# EAGLE design breakout (EAGLE 7.5.0)
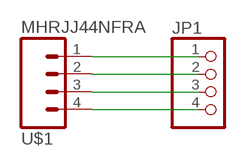
[diagram p0: schematic, sheet 1]

## Parts
JP1  PINHD-1X4  [1X04]
U$1  MHRJJ44NFRA  RJ9PTH  [RJ9]

## Nets
N$1: JP1.1 U$1.1
N$2: JP1.2 U$1.2
N$3: JP1.3 U$1.3
N$4: JP1.4 U$1.4

## Library data of the parts
JP1 = pinhead:PINHD-1X4: PIN HEADER
U$1 = SparkFun-Connectors:RJ9: RJ9 connector (e.g., phone handsets)

## Board
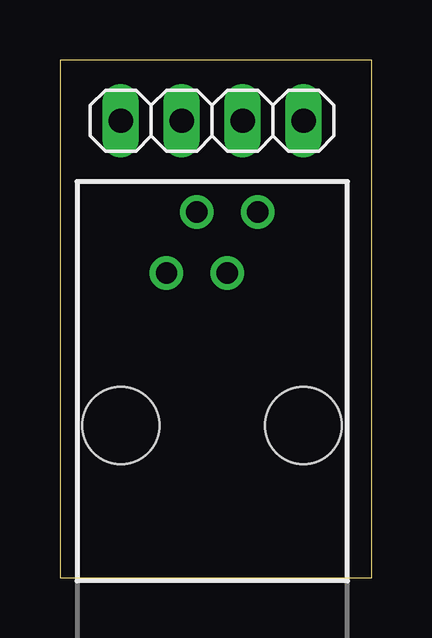
[diagram p1: board, top side]
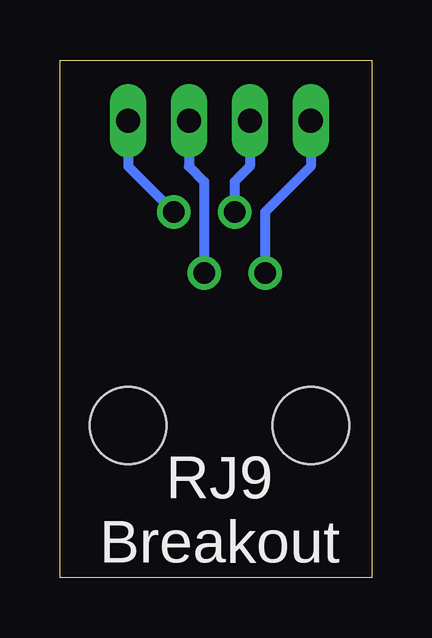
[diagram p2: board, bottom side, seen from below]

Size 13.01 x 21.58 mm. Coordinates in mm from the lower left corner, seen from the top.
Outline: 0,0 13.01,0 13.01,21.58 0,21.58 0,0
Copper layers (1*16): Top 0.035mm / dielectric 1.5mm / Bottom 0.035mm
Design rules "default": minimum track width 10mil, minimum drill 24mil, track to track 8mil, track to pad 8mil, pad to pad 8mil, via to via 8mil, smd to smd 8mil, copper to edge 40mil, drill to drill 8mil, minimum pad ring 10mil, minimum via ring 8mil, stop-mask expansion 4mil, vias tented up to drill 0mil, thermal gap 10mil

### Footprints (pad centres in the part's own frame; a part is rotated, then mirrored left to right if it is on the bottom)
1X04 = drill 1.016 long: 1 -3.81,0; 2 -1.27,0; 3 1.27,0; 4 3.81,0
RJ9 = drill 0.889: 1 -1.905,6.35; 2 -0.635,8.89; 3 0.635,6.35; 4 1.905,8.89 | hole 3.2: -3.81,0; 3.81,0

### Placement (x,y rotation side)
JP1  6.35,19.05 0 top
U$1  6.35,6.35 0 top

### Tracks (layer width: path | path; a pad name or v marks a point on that pad's centre or on a via)
N$1
  Bottom 0.406: JP1.1 2.54,17.14 4.45,15.24 U$1.1
N$2
  Bottom 0.406: JP1.2 5.08,17.14 5.71,16.51 U$1.2
N$3
  Bottom 0.406: JP1.3 7.62,17.14 6.99,16.51 U$1.3
N$4
  Bottom 0.406: JP1.4 10.16,17.14 U$1.4

### Text on the board
bPlace: RJ9 / Breakout